# Altium schematic sheet P04_MCU.SchDoc
size A4
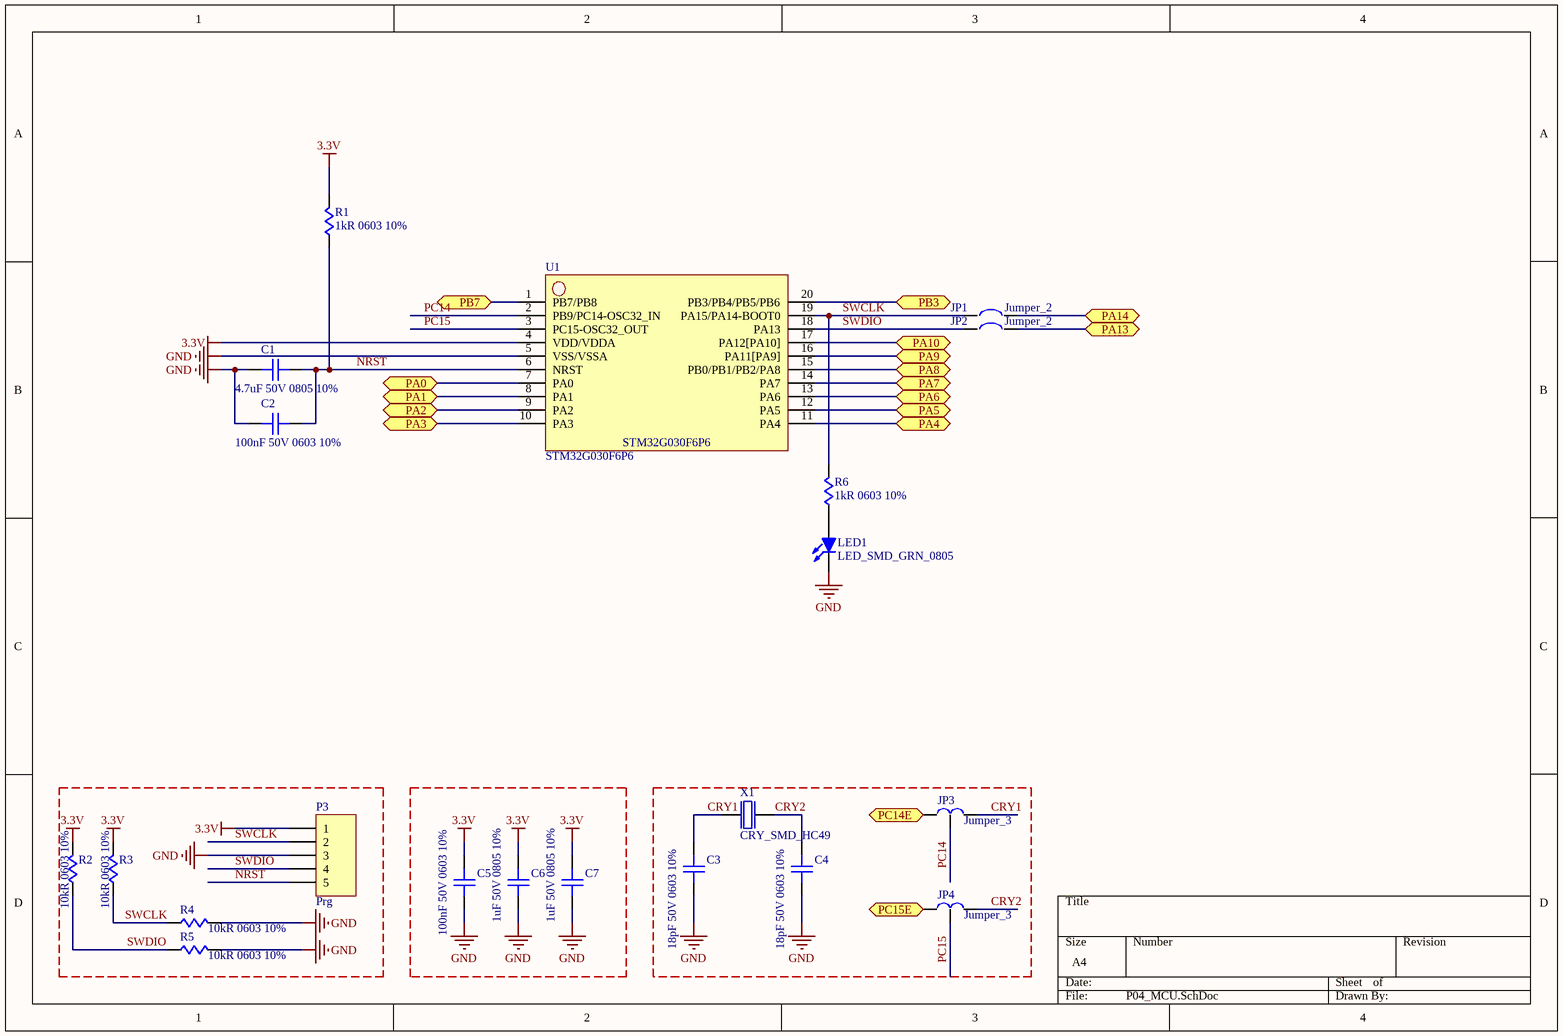
[diagram p0: P04_MCU.SchDoc]

## Parts
C1  4.7uF 50V 0805 10%  [CAPC-0805-M]
C2  100nF 50V 0603 10%  [CAPC-0603-M]
C3  18pF 50V 0603 10%  [CAPC-0603-M]
C4  18pF 50V 0603 10%  [CAPC-0603-M]
C5  100nF 50V 0603 10%  [CAPC-0603-M]
C6  1uF 50V 0805 10%  [CAPC-0805-M]
C7  1uF 50V 0805 10%  [CAPC-0805-M]
JP1  Jumper_2  [JMP_SMD_2]
JP2  Jumper_2  [JMP_SMD_2]
JP3  Jumper_3  [JMP_SMD_3]
JP4  Jumper_3  [JMP_SMD_3]
LED1  LED_SMD_GRN_0805  [LED-GRN-0805-M]
P3  Prg  [HDR_1_5_M_180]
R1  1kR 0603 10%  [RESC-0603-M]
R2  10kR 0603 10%  [RESC-0603-M]
R3  10kR 0603 10%  [RESC-0603-M]
R4  10kR 0603 10%  [RESC-0603-M]
R5  10kR 0603 10%  [RESC-0603-M]
R6  1kR 0603 10%  [RESC-0603-M]
U1  STM32G030F6P6  [TSOP-20-M]
X1  CRY_SMD_HC49  [HC49 US]

## Ports
PA0, PA1, PA2, PA3, PA4, PA5, PA6, PA7, PA8, PA9, PA10, PA13, PA14, PB3, PB7, PC14E, PC15E

## Nets
3.3V: C5.1 C6.1 C7.1 P3.1 R1.2(B) R2.2(B) R3.2(B) U1.4(VDD/VDDA)
GND: C1.2 C2.2 C3.2 C4.2 C5.2 C6.2 C7.2 LED1.2(K) P3.3 R4.2(B) R5.2(B) U1.5(VSS/VSSA)
CRY1: C3.1 JP3.3(C) X1.1(A)
CRY2: C4.1 JP4.3(C) X1.2(B)
NRST: C1.1 C2.1 P3.5 R1.1(A) U1.6(NRST)
PA0: U1.7(PA0) ; port PA0
PA1: U1.8(PA1) ; port PA1
PA2: U1.9(PA2) ; port PA2
PA3: U1.10(PA3) ; port PA3
PA4: U1.11(PA4) ; port PA4
PA5: U1.12(PA5) ; port PA5
PA6: U1.13(PA6) ; port PA6
PA7: U1.14(PA7) ; port PA7
PA8: U1.15(PB0/PB1/PB2/PA8) ; port PA8
PA9: U1.16(PA11[PA9]) ; port PA9
PA10: U1.17(PA12[PA10]) ; port PA10
PA13: JP2.2(B) ; port PA13
PA14: JP1.2(B) ; port PA14
PB3: U1.20(PB3/PB4/PB5/PB6) ; port PB3
PB7: U1.1(PB7/PB8) ; port PB7
PC14: JP3.2(B) U1.2(PB9/PC14-OSC32_IN)
PC14E: JP3.1(A) ; port PC14E
PC15: JP4.2(B) U1.3(PC15-OSC32_OUT)
PC15E: JP4.1(A) ; port PC15E
SWCLK: JP1.1(A) P3.2 R3.1(A) R4.1(A) R6.2(B) U1.19(PA15/PA14-BOOT0)
SWDIO: JP2.1(A) P3.4 R2.1(A) R5.1(A) U1.18(PA13)
NetLED1_1: LED1.1(A) R6.1(A)

## Library data of the parts
C1 C6 C7 = CAP_SMD_0805
C2-C5 = CAP_SMD_0603
P3 = Header 5: Header, 5-Pin; LatestRevisionDate: 17-Jul-2002; LatestRevisionNote: Re-released for DXP Platform.; Publisher: Altium Limited
R1-R6 = RES_SMD_0603